# Altium project remote.PrjPCB
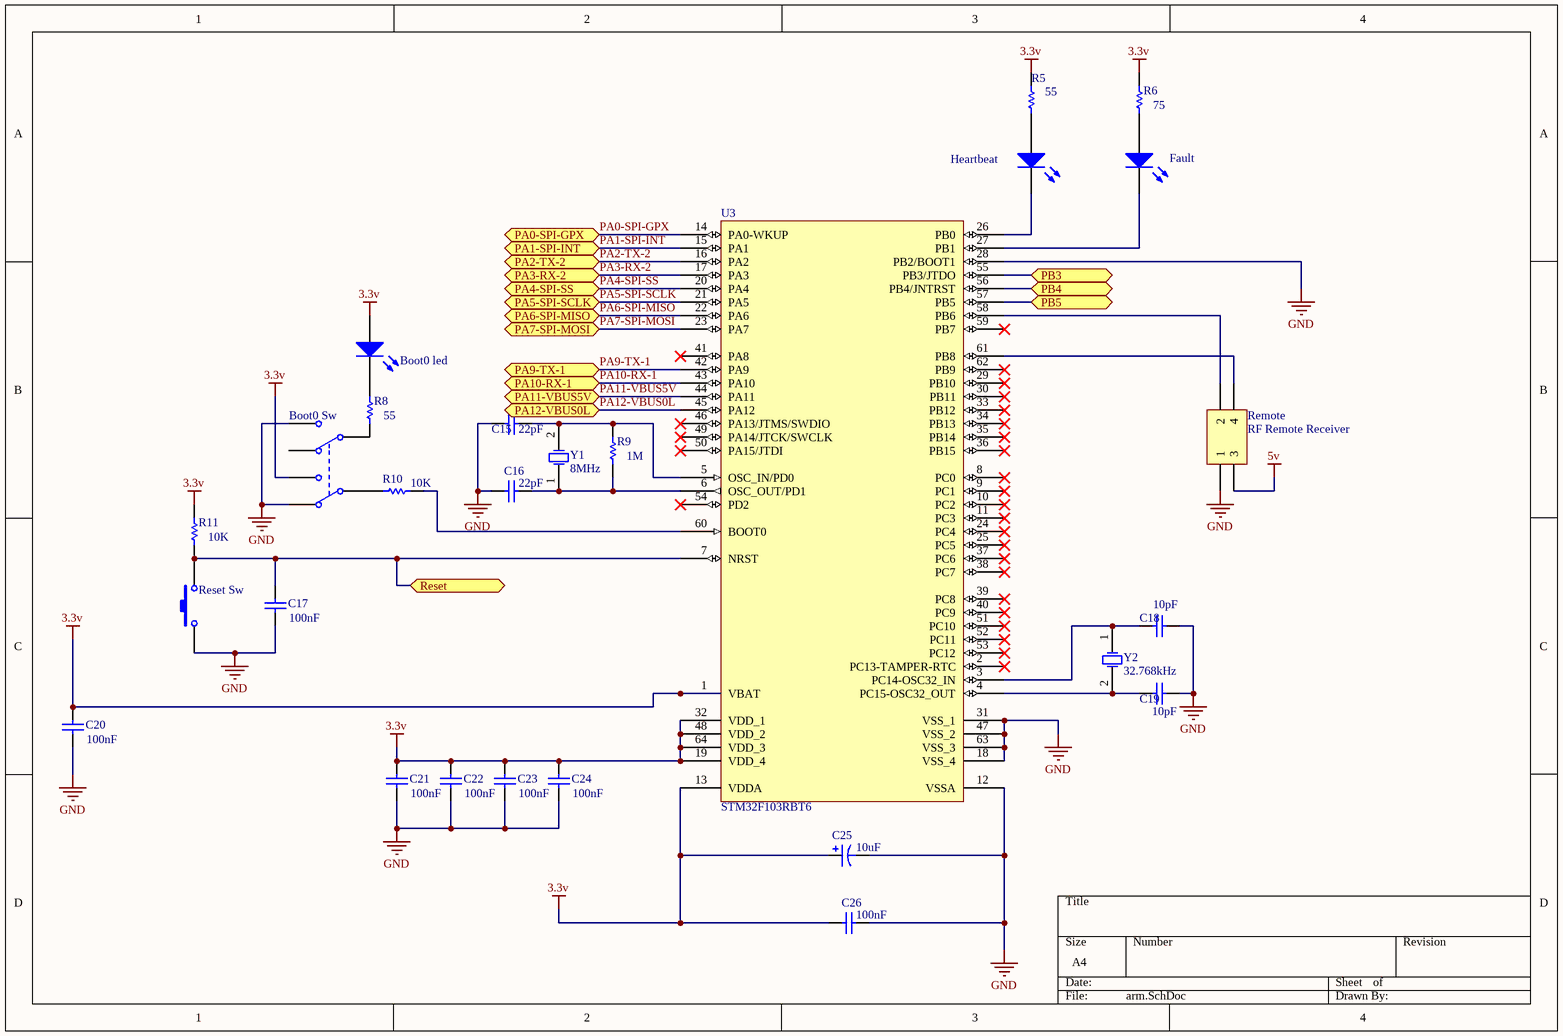
[diagram p0: arm.SchDoc]
3 sheets, 97 parts. Net scope: flat (ports and power ports of the same name join across sheets).
Board files: board.PcbDoc, ground plane.PcbDoc
Sheets:
  arm.SchDoc
  alim.SchDoc
  communication.SchDoc

## Sheet arm.SchDoc: Arm Schematic
size A4; Author: Rémi St-Onge; DrawnBy: Rémi St-Onge; DocumentName: Arm schematic

### Parts
Boot0  Boot0 led  [3.2X1.6X1.1]
Boot0_Sw  BOOT0 SW  [Switch DPDT]  (value not drawn)
C15  value 22pF  [CAPC1608L]  (hidden comment: Cap)
C16  value 22pF  [CAPC1608L]  (hidden comment: Cap)
C17  value 100nF  [CAPC1608L]  (hidden comment: Cap)
C18  value 10pF  [CAPC1608L]  (hidden comment: Cap)
C19  value 10pF  [CAPC1608L]  (hidden comment: Cap)
C20  value 100nF  [CAPC1608L]  (hidden comment: Cap)
C21  value 100nF  [CAPC1608L]  (hidden comment: Cap)
C22  value 100nF  [CAPC1608L]  (hidden comment: Cap)
C23  value 100nF  [CAPC1608L]  (hidden comment: Cap)
C24  value 100nF  [CAPC1608L]  (hidden comment: Cap)
C25  value 10uF  [CAPC3216M]  (hidden comment: Cap Pol3)
C26  value 100nF  [CAPC1608L]  (hidden comment: Cap)
Fault  Fault LED  [3.2X1.6X1.1]  (value not drawn)
Heartbeat  Heartbeat LED  [3.2X1.6X1.1]  (value not drawn)
R5  value 55  [RESC1608L]  (hidden comment: Res1)
R6  value 75  [RESC1608L]  (hidden comment: Res1)
R8  value 55  [RESC1608L]  (hidden comment: Res1)
R9  value 1M  [RESC1608L]  (hidden comment: Res1)
R10  value 10K  [RESC1608L]  (hidden comment: Res1)
R11  value 10K  [RESC1608L]  (hidden comment: Res1)
Remote  RF Remote Receiver  [NES connector]
Reset_Sw  RESET SW  [tackSwitch]  (value not drawn)
U3  STM32F103RBT6  [LQFP64_N]
Y1  8MHz  [HC-49U]
Y2  32.768kHz  [R26]

### Ports
PA0-SPI-GPX, PA1-SPI-INT, PA2-TX-2, PA3-RX-2, PA4-SPI-SS, PA5-SPI-SCLK, PA6-SPI-MISO, PA7-SPI-MOSI, PA9-TX-1, PA10-RX-1, PA11-VBUS5V, PA12-VBUS0L, PB3 (bidir), PB4 (bidir), PB5 (bidir), Reset

### Nets
3.3v: Boot0.1(A) Boot0_Sw.2(NO1) C20.2 C21.2 C22.2 C23.2 C24.2 C25.1 C26.1 R5.2 R6.2 R11.2 U3.1(VBAT) U3.13(VDDA) U3.19(VDD_4) U3.32(VDD_1) U3.48(VDD_2) U3.64(VDD_3)
5v: Remote.3
GND: Boot0_Sw.1(NC1) Boot0_Sw.6(NO2) C15.1 C16.1 C17.1 C18.1 C19.1 C20.1 C21.1 C22.1 C23.1 C24.1 C25.2 C26.2 Remote.1 Reset_Sw.1 U3.12(VSSA) U3.18(VSS_4) U3.28(PB2/BOOT1) U3.31(VSS_1) U3.47(VSS_2) U3.63(VSS_3)
PA0-SPI-GPX: U3.14(PA0-WKUP) ; port PA0-SPI-GPX
PA1-SPI-INT: U3.15(PA1) ; port PA1-SPI-INT
PA2-TX-2: U3.16(PA2) ; port PA2-TX-2
PA3-RX-2: U3.17(PA3) ; port PA3-RX-2
PA4-SPI-SS: U3.20(PA4) ; port PA4-SPI-SS
PA5-SPI-SCLK: U3.21(PA5) ; port PA5-SPI-SCLK
PA6-SPI-MISO: U3.22(PA6) ; port PA6-SPI-MISO
PA7-SPI-MOSI: U3.23(PA7) ; port PA7-SPI-MOSI
PA9-TX-1: U3.42(PA9) ; port PA9-TX-1
PA10-RX-1: U3.43(PA10) ; port PA10-RX-1
PA11-VBUS5V: U3.44(PA11) ; port PA11-VBUS5V
PA12-VBUS0L: U3.45(PA12) ; port PA12-VBUS0L
NetBoot0_2: Boot0.2(K) R8.2
NetBoot0_Sw_3: Boot0_Sw.3(COMMON1) R10.1
NetBoot0_Sw_4: Boot0_Sw.4(COMMON2) R8.1
NetC15_2: C15.2 R9.1 U3.5(OSC_IN/PD0) Y1.2(OSC2)
NetC16_2: C16.2 R9.2 U3.6(OSC_OUT/PD1) Y1.1(OSC1)
NetC17_2: C17.2 R11.1 Reset_Sw.2 U3.7(NRST) ; port Reset
NetC18_2: C18.2 U3.3(PC14-OSC32_IN) Y2.1(OSC1)
NetC19_2: C19.2 U3.4(PC15-OSC32_OUT) Y2.2(OSC2)
NetFault_1: Fault.1(A) R6.1
NetFault_2: Fault.2(K) U3.27(PB1)
NetHeartbeat_1: Heartbeat.1(A) R5.1
NetHeartbeat_2: Heartbeat.2(K) U3.26(PB0)
NetNES_1: U3.57(PB5) ; port PB5
NetR10_2: R10.2 U3.60(BOOT0)
NetRemote_2: Remote.2 U3.58(PB6)
NetRemote_4: Remote.4 U3.61(PB8)
NetU3_55: U3.55(PB3/JTDO) ; port PB3
NetU3_56: U3.56(PB4/JNTRST) ; port PB4

Not connected (* = marked no-connect by the designer): Boot0_Sw 5(NC2); U3 2(PC13-TAMPER-RTC)* 8(PC0)* 9(PC1)* 10(PC2)* 11(PC3)* 24(PC4)* 25(PC5)* 29(PB10)* 30(PB11)* 33(PB12)* 34(PB13)* 35(PB14)* 36(PB15)* 37(PC6)* 38(PC7)* 39(PC8)* 40(PC9)* 41(PA8)* 46(PA13/JTMS/SWDIO)* 49(PA14/JTCK/SWCLK)* 50(PA15/JTDI)* 51(PC10)* 52(PC11)* 53(PC12)* 54(PD2)* 59(PB7)* 62(PB9)*

### Library data of the parts
Boot0 Fault Heartbeat = LED2: Typical RED, GREEN, YELLOW, AMBER GaAs LED; Published: 8-Jun-2000; LatestRevisionDate: 17-Jul-2002; LatestRevisionNote: Re-released for DXP Platform.; PackageVersion: Feb-2002; PackageReference: 3.2X1.6X1.1; Publisher: Altium Limited
Boot0_Sw = SW DPDT: Switch; Published: 24-Mar-1999; LatestRevisionDate: 29-May-2009; LatestRevisionNote: IPC-7351 Footprint Added.; PackageVersion: Mar-2001; PackageReference: SOT23-6; Publisher: Altium Limited; PackageDescription: 6-Pin SOT-23 Package 0.95 mm Pitch, 2.7 mm Lead Span; Code_JEITA: SC-74; Code_IPC: SOT26A-6
C15-C24 C26 = Cap: Capacitor; Published: 8-Jun-2000; LatestRevisionDate: 17-Jul-2002; LatestRevisionNote: Re-released for DXP Platform.; PackageReference: RAD-0.3; Publisher: Altium Limited
C25 = Cap Pol3: Polarized Capacitor (Surface Mount); Published: 8-Jun-2000; LatestRevisionDate: 29-May-2009; LatestRevisionNote: IPC-7351 Footprint Added.; PackageReference: C0805; Publisher: Altium Limited; PackageDescription: Chip Capacitor
R5 R6 R8-R11 = Res1: Resistor; Published: 8-Jun-2000; LatestRevisionDate: 17-Jul-2002; LatestRevisionNote: Re-released for DXP Platform.; PackageReference: AXIAL-0.3; Publisher: Altium Limited
Remote = Header 2X2: Header, 2-Pin, Dual row; LatestRevisionDate: 17-Jul-2002; LatestRevisionNote: Re-released for DXP Platform.; Publisher: Altium Limited
Reset_Sw = SW-PB: Switch; Published: 24-Mar-1999; LatestRevisionDate: 17-Jul-2002; LatestRevisionNote: Re-released for DXP Platform.; PackageReference: SPST-2; Publisher: Altium Limited
U3 = STM32F103RBT6: STM32 ARM-based 32-bit MCU with 128 Kbytes Flash, 64-pin LQFP, Industrial Temperature; Published: 30-May-2008; DatasheetVersion: rev6, Mar-2008; PackageVersion: Mar-2008; PackageReference: LQFP64; Publisher: Altium Limited; PackageDescription: 64-Pin Low-Profile Quad Flat Pack, 10 x 10 mm Body, 0.5 mm Pitch (LQFP64); ComponentLink1Description: Manufacturer Link; ComponentLink1URL: www.st.com/stm32; ComponentLink2Description: Datasheet; ComponentLink2URL: http://www.st.com/stonline/products/literature/ds/13587.pdf
Y1 Y2 = XTAL: Crystal Oscillator; Published: 8-Jun-2000; LatestRevisionDate: 17-Jul-2002; LatestRevisionNote: Re-released for DXP Platform.; PackageReference: R38; Publisher: Altium Limited

## Sheet alim.SchDoc
size A4
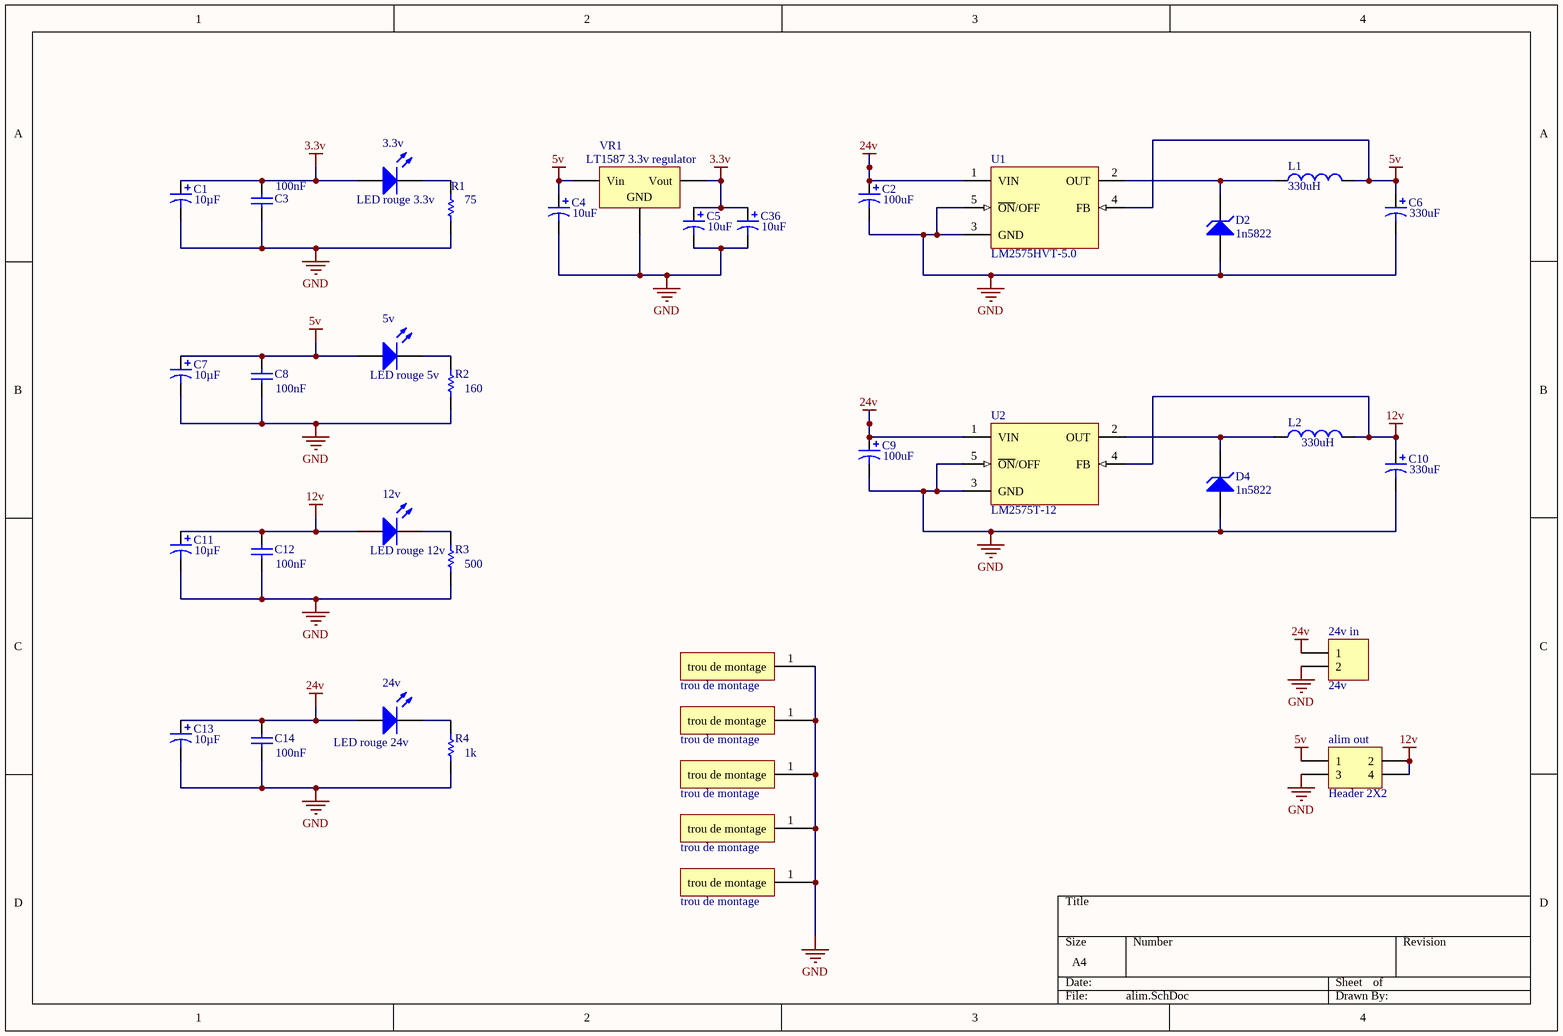
[diagram p1: alim.SchDoc]

### Parts
3.3v  LED rouge 3.3v  [3.2X1.6X1.1]
5v  LED rouge 5v  [3.2X1.6X1.1]
12v  LED rouge 12v  [3.2X1.6X1.1]
24v  LED rouge 24v  [3.2X1.6X1.1]
24v_in  24v  [power connector]
alim_out  Header 2X2  [5v et 12v connector]
C1  value 10µF  [CAPC3216M]  (hidden comment: Cap Pol3)
C2  value 100uF  [CAPPR2-5x6.8]  (hidden comment: Cap Pol3)
C3  value 100nF  [CAPC1608L]  (hidden comment: Cap)
C4  value 10uF  [CAPC3216M]  (hidden comment: Cap Pol3)
C5  value 10uF  [CAPC3216M]  (hidden comment: Cap Pol3)
C6  value 330uF  [CAPPR5-10x12.5]  (hidden comment: Cap Pol3)
C7  value 10µF  [CAPC3216M]  (hidden comment: Cap Pol3)
C8  value 100nF  [CAPC1608L]  (hidden comment: Cap)
C9  value 100uF  [CAPPR2-5x6.8]  (hidden comment: Cap Pol3)
C10  value 330uF  [CAPPR5-10x12.5]  (hidden comment: Cap Pol3)
C11  value 10µF  [CAPC3216M]  (hidden comment: Cap Pol3)
C12  value 100nF  [CAPC1608L]  (hidden comment: Cap)
C13  value 10µF  [CAPC3216M]  (hidden comment: Cap Pol3)
C14  value 100nF  [CAPC1608L]  (hidden comment: Cap)
C36  value 10uF  [CAPC3216M]  (hidden comment: Cap Pol3)
D2  1n5822  [DIO18.84-9.6x5.6]
D4  1n5822  [DIO18.84-9.6x5.6]
L1  value 330uH  [CAPC4532L]  (hidden comment: Inductor)
L2  value 330uH  [CAPC4532L]  (hidden comment: Inductor)
R1  value 75  [RESC1608L]  (hidden comment: Res1)
R2  value 160  [RESC1608L]  (hidden comment: Res1)
R3  value 500  [RESC1608L]  (hidden comment: Res1)
R4  value 1k  [RESC1608L]  (hidden comment: Res1)
T1  trou de montage  [trou de montage]
T2  trou de montage  [trou de montage]
T3  trou de montage  [trou de montage]
T4  trou de montage  [trou de montage]
T5  trou de montage  [trou de montage]
U1  LM2575HVT-5.0  [TO170P1524X460-6N]
U2  LM2575T-12  [TO170P1524X460-6N]
VR1  LT1587 3.3v regulator  [TO254P1435X457-4N]

### Nets
3.3v: 3.3v.1(A) C1.1 C3.2 C5.1 C36.1 VR1.3(Vout)
5v: 5v.1(A) alim_out.1 C4.1 C6.1 C7.1 C8.2 L1.2 U1.4(FB) VR1.1(Vin)
12v: 12v.1(A) alim_out.2 alim_out.4 C10.1 C11.1 C12.2 L2.2 U2.4(FB)
24v: 24v.1(A) 24v_in.1 C2.1 C9.1 C13.1 C14.2 U1.1(VIN) U2.1(VIN)
GND: 24v_in.2 alim_out.3 C1.2 C2.2 C3.1 C4.2 C5.2 C6.2 C7.2 C8.1 C9.2 C10.2 C11.2 C12.1 C13.2 C14.1 C36.2 D2.1(A) D4.1(A) R1.1 R2.1 R3.1 R4.1 T1.1(trou_de_montage) T2.1(trou_de_montage) T3.1(trou_de_montage) T4.1(trou_de_montage) T5.1(trou_de_montage) U1.3(GND) U1.5(~{ON}/OFF) U2.3(GND) U2.5(~{ON}/OFF) VR1.2(GND)
Net3.3v_2: 3.3v.2(K) R1.2
Net5v_2: 5v.2(K) R2.2
Net12v_2: 12v.2(K) R3.2
Net24v_2: 24v.2(K) R4.2
NetD2_2: D2.2(K) L1.1 U1.2(OUT)
NetD4_2: D4.2(K) L2.1 U2.2(OUT)

### Library data of the parts
3.3v 5v 12v 24v = LED2: as Boot0 on sheet arm; Published: 8-Jun-2000; LatestRevisionDate: 17-Jul-2002; LatestRevisionNote: Re-released for DXP Platform.; PackageVersion: Feb-2002; PackageReference: 3.2X1.6X1.1; Publisher: Altium Limited
24v_in = Header 2: Header, 2-Pin; LatestRevisionDate: 17-Jul-2002; LatestRevisionNote: Re-released for DXP Platform.; Publisher: Altium Limited
alim_out = Header 2X2: Header, 2-Pin, Dual row; LatestRevisionDate: 17-Jul-2002; LatestRevisionNote: Re-released for DXP Platform.; Publisher: Altium Limited
C1 C2 C4-C7 C9-C11 C13 C36 = Cap Pol3: Polarized Capacitor (Surface Mount); Published: 8-Jun-2000; LatestRevisionDate: 29-May-2009; LatestRevisionNote: IPC-7351 Footprint Added.; PackageReference: C0805; Publisher: Altium Limited; PackageDescription: Chip Capacitor
C3 C8 C12 C14 = Cap: Capacitor; Published: 8-Jun-2000; LatestRevisionDate: 17-Jul-2002; LatestRevisionNote: Re-released for DXP Platform.; PackageReference: RAD-0.3; Publisher: Altium Limited
D2 D4 = D Zener: Zener Diode; Published: 8-Jun-2000; LatestRevisionDate: 17-Jul-2002; LatestRevisionNote: Re-released for DXP Platform.; PackageReference: DIODE-0.7; Publisher: Altium Limited
L1 L2 = Inductor: Code_IEC: 1005; Published: 8-Jun-2000; LatestRevisionDate: 29-May-2009; LatestRevisionNote: IPC-7351 Footprint Added.; PackageReference: 0402-A; Publisher: Altium Limited; PackageDescription: Chip Inductor; Code_JEITA: 0402
R1-R4 = Res1: Resistor; Published: 8-Jun-2000; LatestRevisionDate: 17-Jul-2002; LatestRevisionNote: Re-released for DXP Platform.; PackageReference: AXIAL-0.3; Publisher: Altium Limited
U1 = LM2575HVT-5.0: SIMPLE SWITCHER 1A Step-Down Voltage Regulator; Manufacturer: National Semiconductor; PackageTopMarking: NSUZXYTT*LM2575HVT*-5.0 P+; PowerWise: N; Published: 4-Dec-2008; DatasheetVersion: Apr-2007; PackageVersion: revJ, Jan-1992; PackageReference: T05A; Publisher: Altium Limited; PackageDescription: TO-220, Molded, 5 Lead, Straight; CompType: Switcher; PartNumber: LM2575HVT-5.0; RoHS: O; PinCount: 5; DigiKeyPartNumber: LM2575HVT-5.0-ND; Code_JEDEC: TO-220-AB; ComponentLink1Description: LM2575HV Datasheet; ComponentLink1URL: http://www.national.com/ds/LM/LM2575HV.pdf; ComponentLink2Description: LM2575HV Web Page; ComponentLink2URL: http://www.national.com/pf/LM/LM2575HV.html; ComponentLink3Description: T05A Package Page; ComponentLink3URL: http://www.national.com/packaging/folders/t05a.html
U2 = LM2575T-12: SIMPLE SWITCHER 1A Step-Down Voltage Regulator; Manufacturer: National Semiconductor; PackageTopMarking: NSUZXYTT*LM2575T*-12 P+; PowerWise: N; Published: 4-Dec-2008; DatasheetVersion: Apr-2007; PackageVersion: revJ, Jan-1992; PackageReference: T05A; Publisher: Altium Limited; PackageDescription: TO-220, Molded, 5 Lead, Straight; CompType: Switcher; PartNumber: LM2575T-12; RoHS: O; PinCount: 5; DigiKeyPartNumber: LM2575T-12-ND; Code_JEDEC: TO-220-AB; ComponentLink1Description: LM2575 Datasheet; ComponentLink1URL: http://www.national.com/ds/LM/LM2575.pdf; ComponentLink2Description: LM2575 Web Page; ComponentLink2URL: http://www.national.com/pf/LM/LM2575.html; ComponentLink3Description: T05A Package Page; ComponentLink3URL: http://www.national.com/packaging/folders/t05a.html
VR1 = Volt Reg: Voltage Regulator; Published: 24-Mar-1999; LatestRevisionDate: 29-May-2009; LatestRevisionNote: IPC-7351 Footprint Added.; PackageReference: D2PAK; Publisher: Altium Limited; PackageDescription: 3-Pin Transistor Outline Package 2.54 mm Pitch, 15.1 mm Lead Span

## Sheet communication.SchDoc: Connector Page
size A4; DrawnBy: Rémi St-Onge; Revision: 1
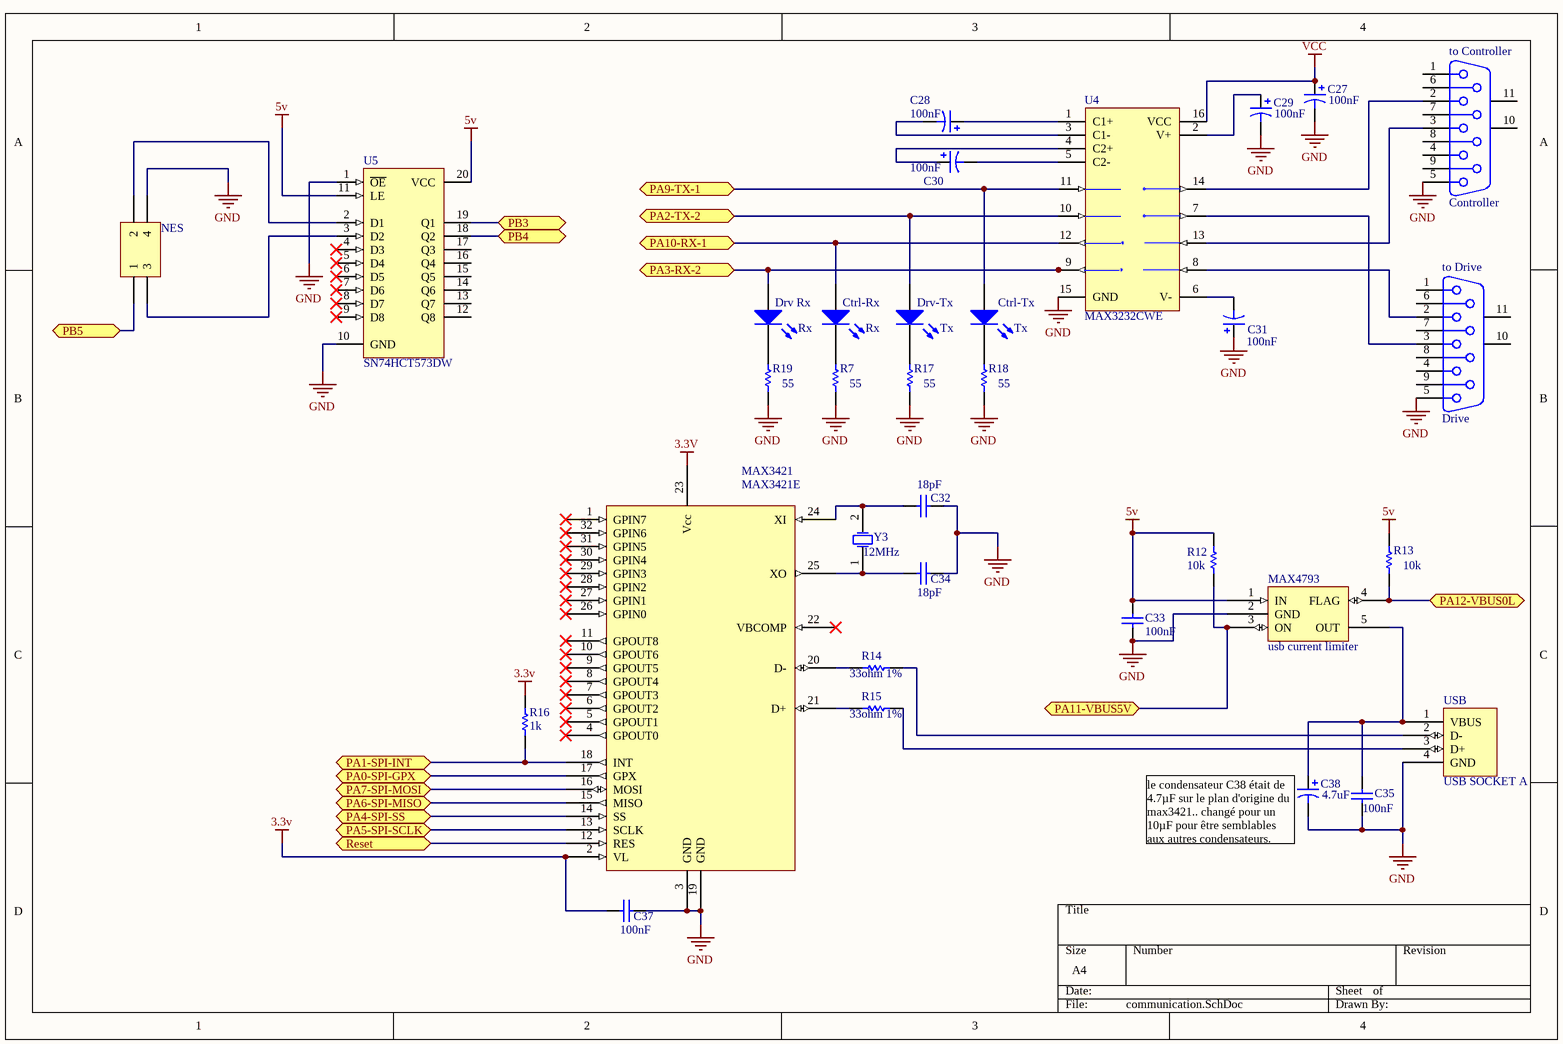
[diagram p2: communication.SchDoc]

### Parts
C27  value 100nF  [CAPC3216M]  (hidden comment: Cap Pol3)
C28  value 100nF  [CAPC3216M]  (hidden comment: Cap Pol3)
C29  value 100nF  [CAPC3216M]  (hidden comment: Cap Pol3)
C30  value 100nF  [CAPC3216M]  (hidden comment: Cap Pol3)
C31  value 100nF  [CAPC3216M]  (hidden comment: Cap Pol3)
C32  value 18pF  [CAPC1608L]  (hidden comment: Cap)
C33  value 100nF  [CAPC1608L]  (hidden comment: Cap)
C34  value 18pF  [CAPC1608L]  (hidden comment: Cap)
C35  value 100nF  [CAPC1608L]  (hidden comment: Cap)
C37  value 100nF  [CAPC1608L]  (hidden comment: Cap)
C38  value 4.7uF  [CAPC3216M]  (hidden comment: Cap Pol3)
Ctrl-Rx  Rx  [3.2X1.6X1.1]
Ctrl-Tx  Tx  [3.2X1.6X1.1]
Drv-Tx  Tx  [3.2X1.6X1.1]
Drv_Rx  Rx  [3.2X1.6X1.1]
MAX3421  MAX3421E  [TQFP32_L]
MAX4793  usb current limiter  [SOT95P280X145-5N]
NES  NES  [NES connector]  (value not drawn)
R7  value 55  [RESC1608L]  (hidden comment: Res1)
R12  value 10k  [RESC1608L]  (hidden comment: Res1)
R13  value 10k  [RESC1608L]  (hidden comment: Res1)
R14  value 33ohm 1%  [RESC1608L]  (hidden comment: Res1)
R15  value 33ohm 1%  [RESC1608L]  (hidden comment: Res1)
R16  value 1k  [RESC1608L]  (hidden comment: Res1)
R17  value 55  [RESC1608L]  (hidden comment: Res1)
R18  value 55  [RESC1608L]  (hidden comment: Res1)
R19  value 55  [RESC1608L]  (hidden comment: Res1)
to_Controller  Controller  [DSUB1.385-2H9]
to_Drive  Drive  [DSUB1.385-2H9]
U4  MAX3232CWE  [WSO16_N]
U5  SN74HCT573DW  [DW020_N]
USB  USB SOCKET A  [USB2.5-2H4B]
Y3  12MHz  [HC-49U]

### Ports
PA0-SPI-GPX, PA1-SPI-INT, PA2-TX-2 (bidir), PA3-RX-2 (bidir), PA4-SPI-SS, PA5-SPI-SCLK, PA6-SPI-MISO, PA7-SPI-MOSI, PA9-TX-1, PA10-RX-1 (bidir), PA11-VBUS5V, PA12-VBUS0L (bidir), PB3 (bidir), PB4 (bidir), PB5, Reset

### Nets
3.3v: C37.1 MAX3421.2(VL) MAX3421.23(Vcc) R16.2
5v: C33.2 MAX4793.1(IN) R12.2 R13.2 U5.11(LE) U5.20(VCC)
GND: C27.2 C29.2 C31.1 C32.2 C33.1 C34.2 C35.1 C37.2 C38.2 MAX3421.3(GND) MAX3421.19(GND) MAX4793.2(GND) NES.4 R7.1 R17.1 R18.1 R19.1 to_Controller.5 to_Drive.5 U4.15(GND) U5.1(~{OE}) U5.10(GND) USB.4(GND)
VCC: C27.1 U4.16(VCC)
PA0-SPI-GPX: MAX3421.17(GPX) ; port PA0-SPI-GPX
PA1-SPI-INT: MAX3421.18(INT) R16.1 ; port PA1-SPI-INT
PA2-TX-2: Drv-Tx.1(A) U4.10(T2IN) ; port PA2-TX-2
PA3-RX-2: Drv_Rx.1(A) U4.9(R2OUT) ; port PA3-RX-2
PA4-SPI-SS: MAX3421.14(SS) ; port PA4-SPI-SS
PA5-SPI-SCLK: MAX3421.13(SCLK) ; port PA5-SPI-SCLK
PA6-SPI-MISO: MAX3421.15(MISO) ; port PA6-SPI-MISO
PA7-SPI-MOSI: MAX3421.16(MOSI) ; port PA7-SPI-MOSI
PA9-TX-1: Ctrl-Tx.1(A) U4.11(T1IN) ; port PA9-TX-1
PA10-RX-1: Ctrl-Rx.1(A) U4.12(R1OUT) ; port PA10-RX-1
PA11-VBUS5V: MAX4793.3(ON) R12.1 ; port PA11-VBUS5V
PA12-VBUS0L: MAX4793.4(FLAG) R13.1 ; port PA12-VBUS0L
NetC17_2: MAX3421.12(RES) ; port Reset
NetC28_1: C28.1 U4.1(C1+)
NetC28_2: C28.2 U4.3(C1-)
NetC29_1: C29.1 U4.2(V+)
NetC30_1: C30.1 U4.4(C2+)
NetC30_2: C30.2 U4.5(C2-)
NetC31_2: C31.2 U4.6(V-)
NetC32_1: C32.1 MAX3421.24(XI) Y3.2(OSC2)
NetC34_1: C34.1 MAX3421.25(XO) Y3.1(OSC1)
NetC35_2: C35.2 C38.1 MAX4793.5(OUT) USB.1(VBUS)
NetCtrl-Rx_2: Ctrl-Rx.2(K) R7.2
NetCtrl-Tx_2: Ctrl-Tx.2(K) R18.2
NetDrv-Tx_2: Drv-Tx.2(K) R17.2
NetDrv_Rx_2: Drv_Rx.2(K) R19.2
NetMAX3421_20: MAX3421.20(D-) R14.1
NetMAX3421_21: MAX3421.21(D+) R15.1
NetNES_1: NES.1 ; port PB5
NetNES_2: NES.2 U5.2(D1)
NetNES_3: NES.3 U5.3(D2)
NetR14_2: R14.2 USB.2(D-)
NetR15_2: R15.2 USB.3(D+)
Netto_Controller_2: to_Controller.2 U4.14(T1OUT)
Netto_Controller_3: to_Controller.3 U4.13(R1IN)
Netto_Drive_2: to_Drive.2 U4.8(R2IN)
Netto_Drive_3: to_Drive.3 U4.7(T2OUT)
NetU3_55: U5.19(Q1) ; port PB3
NetU3_56: U5.18(Q2) ; port PB4

Not connected (* = marked no-connect by the designer): MAX3421 1(GPIN7)* 4(GPOUT0)* 5(GPOUT1)* 6(GPOUT2)* 7(GPOUT3)* 8(GPOUT4)* 9(GPOUT5)* 10(GPOUT6)* 11(GPOUT8)* 22(VBCOMP)* 26(GPIN0)* 27(GPIN1)* 28(GPIN2)* 29(GPIN3)* 30(GPIN4)* 31(GPIN5)* 32(GPIN6)*; to_Controller 1 4 6 7 8 9 10(MH1) 11(MH2); to_Drive 1 4 6 7 8 9 10(MH1) 11(MH2); U5 4(D3)* 5(D4)* 6(D5)* 7(D6)* 8(D7)* 9(D8)* 12(Q8) 13(Q7) 14(Q6) 15(Q5) 16(Q4) 17(Q3)

### Notes on the sheet
- (near C38) le condensateur C38 était de 4.7µF sur le plan d'origine du max3421.. changé pour un 10µF pour être semblables aux autres condensateurs.

### Library data of the parts
C27-C31 C38 = Cap Pol3: Polarized Capacitor (Surface Mount); Published: 8-Jun-2000; LatestRevisionDate: 29-May-2009; LatestRevisionNote: IPC-7351 Footprint Added.; PackageReference: C0805; Publisher: Altium Limited; PackageDescription: Chip Capacitor
C32-C35 C37 = Cap: Capacitor; Published: 8-Jun-2000; LatestRevisionDate: 17-Jul-2002; LatestRevisionNote: Re-released for DXP Platform.; PackageReference: RAD-0.3; Publisher: Altium Limited
Ctrl-Rx Ctrl-Tx Drv-Tx Drv_Rx = LED2: as Boot0 on sheet arm; Published: 8-Jun-2000; LatestRevisionDate: 17-Jul-2002; LatestRevisionNote: Re-released for DXP Platform.; PackageVersion: Feb-2002; PackageReference: 3.2X1.6X1.1; Publisher: Altium Limited
MAX4793 = MAX4793: Published: 24-Mar-1999; LatestRevisionDate: 17-Dec-2003; LatestRevisionNote: Schematic revised, PCB Footprint replaced.; PackageReference: ABSM-1574; Publisher: Altium Limited; ComponentLink1Description: Manufacturer Link; ComponentLink1URL: http://www.megastar.com/linecard/buzzmode/index.php
NES = Header 2X2: Header, 2-Pin, Dual row; LatestRevisionDate: 17-Jul-2002; LatestRevisionNote: Re-released for DXP Platform.; Publisher: Altium Limited
R7 R12-R19 = Res1: Resistor; Published: 8-Jun-2000; LatestRevisionDate: 17-Jul-2002; LatestRevisionNote: Re-released for DXP Platform.; PackageReference: AXIAL-0.3; Publisher: Altium Limited
to_Controller to_Drive = D Connector 9: Receptacle Assembly, 9 Position, Right Angle; PackageDocument: O; Positions: 9; Published: 15-Jun-2001; LatestRevisionDate: 17-Jul-2002; LatestRevisionNote: Re-released for DXP Platform.; DatasheetDocument: 1-Sep-1999; PackageReference: 788750; Publisher: Altium Limited; Orientation: Right Angle; Gender: Receptacle
U4 = MAX3232CWE: 3.0V TO 5.5V, Low-Power, up to 1Mbps, True RS-232 Transceiver Using Four 0.1µF External Capacitor; Published: 16-Jan-2001; LatestRevisionDate: 13-Apr-2006; LatestRevisionNote: IPC-7351 Footprint Added.; DatasheetVersion: Mar-1999; PackageReference: WSO16; Publisher: Altium Limited; PackageDescription: 16-Pin Small Outline Integrated Circuit 1.27 mm Pitch; Code_JEDEC: MS-013-AA; Code_IPC: SOIC127P1030-16; ComponentLink1Description: Manufacturer Link; ComponentLink1URL: http://www.maxim-ic.com/; ComponentLink2Description: Datasheet; ComponentLink2URL: http://pdfserv.maxim-ic.com/en/ds/MAX3222-MAX3241.pdf
U5 = SN74HCT573DW: Octal Transparent D-Type Latch with 3-State Outputs; Published: 8-Jun-2000; LatestRevisionDate: 13-Apr-2006; LatestRevisionNote: IPC-7351 Footprint Added.; DatasheetVersion: Feb-1998; PackageVersion: Mar-2000; PackageReference: DW020; Publisher: Altium Limited; PackageDescription: 20-Pin Plastic Small Outline Integrated Circuit 1.27 mm Pitch; Code_JEDEC: MS-013; Code_IPC: SOIC127P1030-20; ComponentLink1Description: Manufacturer Link; ComponentLink1URL: http://www.ti.com/; ComponentLink2Description: Datasheet; ComponentLink2URL: http://www-s.ti.com/sc/ds/sn74hct573.pdf
Y3 = XTAL: Crystal Oscillator; Published: 8-Jun-2000; LatestRevisionDate: 17-Jul-2002; LatestRevisionNote: Re-released for DXP Platform.; PackageReference: R38; Publisher: Altium Limited
USB = USB SOCKET A: Published: 24-Mar-1999; LatestRevisionDate: 17-Dec-2003; LatestRevisionNote: Schematic revised, PCB Footprint replaced.; PackageReference: ABSM-1574; Publisher: Altium Limited; ComponentLink1Description: Manufacturer Link; ComponentLink1URL: http://www.megastar.com/linecard/buzzmode/index.php

## Nets that join several sheets
3.3v: arm (18 pins), alim (6 pins), communication (C37.1 MAX3421.2 MAX3421.23 R16.2)
5v: arm (Remote.3), alim (9 pins), communication (6 pins)
GND: arm (22 pins), alim (33 pins), communication (23 pins)
NetC17_2: arm (C17.2 R11.1 Reset_Sw.2 U3.7), communication (MAX3421.12)
NetNES_1: arm (U3.57), communication (NES.1)
NetU3_55: arm (U3.55), communication (U5.19)
NetU3_56: arm (U3.56), communication (U5.18)
PA0-SPI-GPX: arm (U3.14), communication (MAX3421.17)
PA1-SPI-INT: arm (U3.15), communication (MAX3421.18 R16.1)
PA2-TX-2: arm (U3.16), communication (Drv-Tx.1 U4.10)
PA3-RX-2: arm (U3.17), communication (Drv_Rx.1 U4.9)
PA4-SPI-SS: arm (U3.20), communication (MAX3421.14)
PA5-SPI-SCLK: arm (U3.21), communication (MAX3421.13)
PA6-SPI-MISO: arm (U3.22), communication (MAX3421.15)
PA7-SPI-MOSI: arm (U3.23), communication (MAX3421.16)
PA9-TX-1: arm (U3.42), communication (Ctrl-Tx.1 U4.11)
PA10-RX-1: arm (U3.43), communication (Ctrl-Rx.1 U4.12)
PA11-VBUS5V: arm (U3.44), communication (MAX4793.3 R12.1)
PA12-VBUS0L: arm (U3.45), communication (MAX4793.4 R13.1)